# EAGLE schematic Schematic_start_module_sumo_IR_V0_16_v1 (EAGLE 9.7.0)
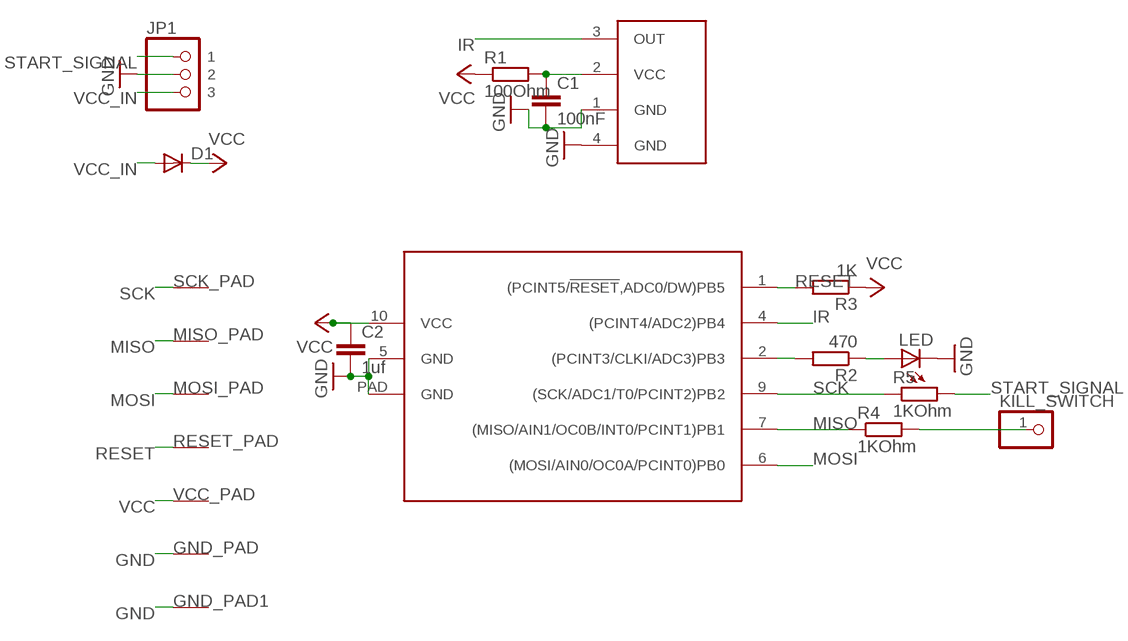
[diagram p0: schematic, sheet 1]

## Parts
C1  100nF  C-EUC0603  [C0603]
C2  1uf  C-EUC0603  [C0603]
D1  DIODE-SOD523  [SOD523]
GND_PAD  PAD50X50  [PAD_50X50]
GND_PAD1  PAD75X75  [PAD_75X75]
IR1  TSOP77338TS  [TSOP77338]
JP1  PINHD-1X3PIN  [1X3]
KILL_SWITCH  PINHD-1X1  [1X01]
LED  LED0603  [0603_SMALL]
MISO_PAD  PAD50X50  [PAD_50X50]
MOSI_PAD  mosi  PAD75X75  [PAD_75X75]
R1  100Ohm  R-EU_R0603  [R0603]
R2  470  R-EU_R0603  [R0603]
R3  1K  R-EU_R0603  [R0603]
R4  1KOhm  R-EU_R0603  [R0603]
R5  1KOhm  R-EU_R0603  [R0603]
RESET_PAD  PAD50X50  [PAD_50X50]
SCK_PAD  PAD50X50  [PAD_50X50]
UC  ATTINY13A  [DFN10]
VCC_PAD  PAD50X50  [PAD_50X50]

## Nets
GND: C1.2 C2.2 GND_PAD1.P$1(PAD) GND_PAD.P$1(PAD) IR1.1(GND) IR1.4(GND) JP1.2 LED.2(C) UC.5(GND) UC.PAD(GND)
IR: IR1.3(OUT) UC.4((PCINT4/ADC2)PB4)
KILL_SWITCH: KILL_SWITCH.1 R4.2
MISO: MISO_PAD.P$1(PAD) R4.1 UC.7((MISO/AIN1/OC0B/INT0/PCINT1)PB1)
MOSI: MOSI_PAD.P$1(PAD) UC.6((MOSI/AIN0/OC0A/PCINT0)PB0)
N$1: R2.2 UC.2((PCINT3/CLKI/ADC3)PB3)
N$3: LED.1(A) R2.1
N$6: C1.1 IR1.2(VCC) R1.2
RESET: R3.2 RESET_PAD.P$1(PAD) UC.1((PCINT5/!RESET,ADC0/DW)PB5)
SCK: R5.1 SCK_PAD.P$1(PAD) UC.9((SCK/ADC1/T0/PCINT2)PB2)
START_SIGNAL: JP1.1 R5.2
VCC: C2.1 D1.C R1.1 R3.1 UC.10(VCC) VCC_PAD.P$1(PAD)
VCC_IN: D1.A JP1.3

## Library data of the parts
C1 C2 = rcl:C-EU: CAPACITOR, European symbol
D1 = diode:DIODE-: DIODE
GND_PAD GND_PAD1 MISO_PAD MOSI_PAD RESET_PAD SCK_PAD VCC_PAD = CRF:PAD
IR1 = CRF:TSOP77338: Liten IR receiver ytmonterad ca 12kr på Farnell. http://www.vishay.com/docs/83346/tsop773.pdf
JP1 = CRF:PINHD-1X3: PIN HEADER
KILL_SWITCH = pinhead:PINHD-1X1: PIN HEADER
LED = CRF:LED: LED
R1-R5 = rcl:R-EU_: RESISTOR, European symbol
UC = CRF:ATTINY13A